# EAGLE schematic Debug (EAGLE 5.09)
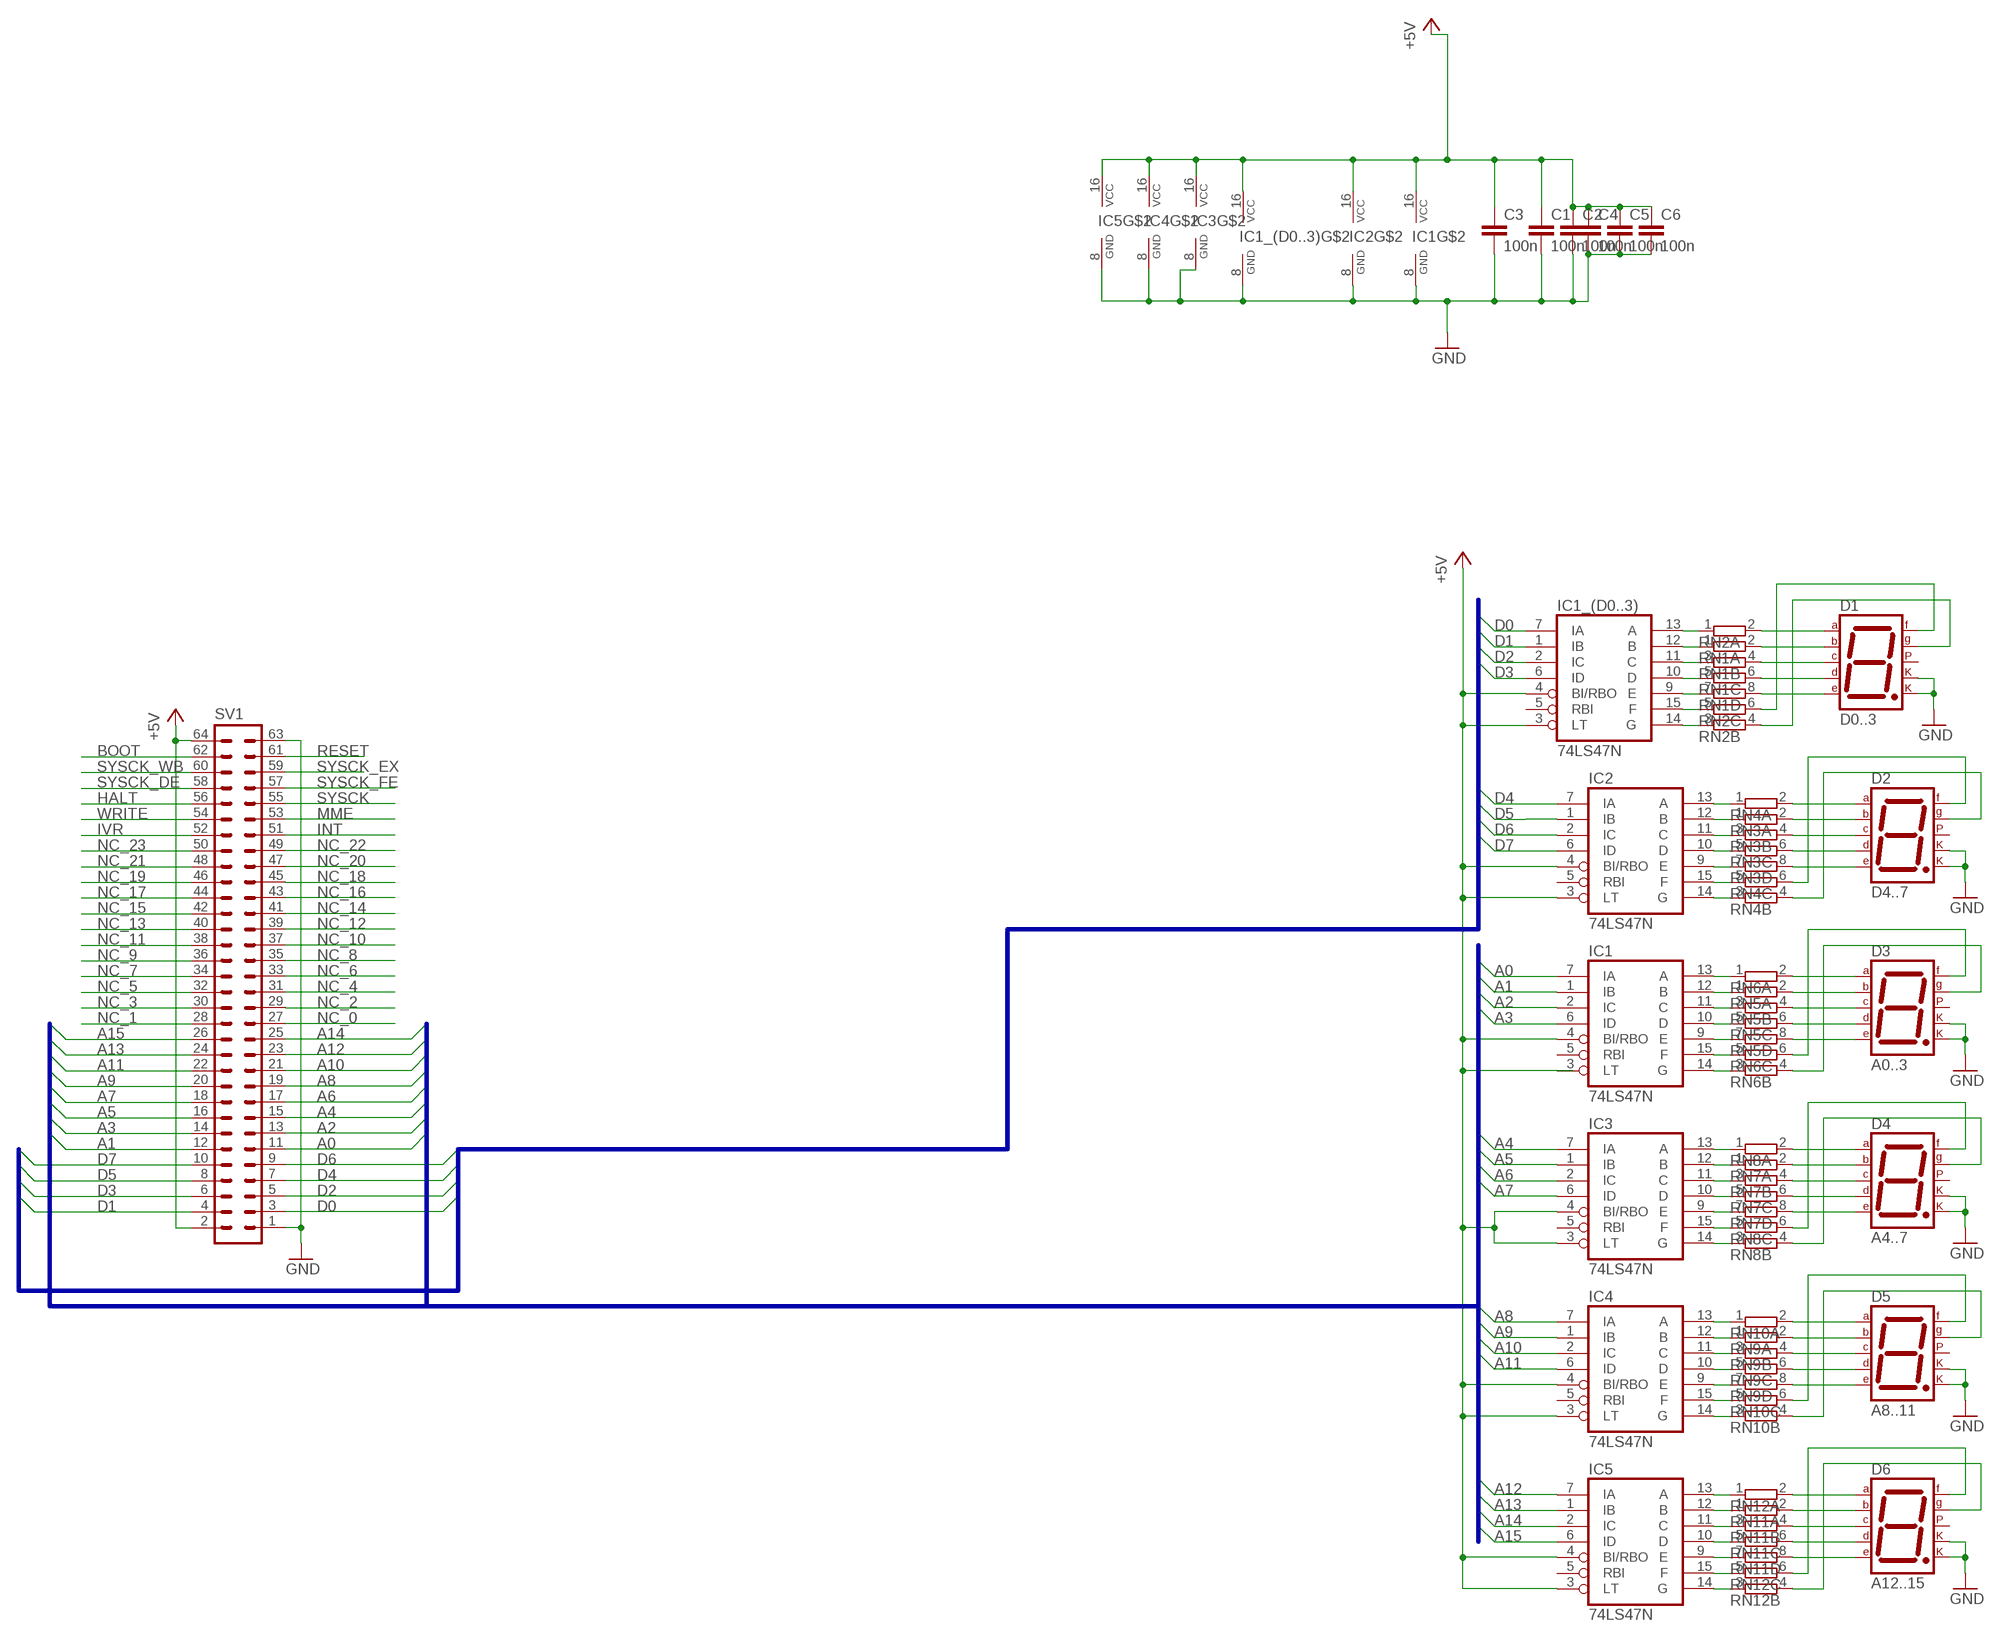
[diagram p0: schematic, sheet 1]

## Parts
C1  100n  C-EU025-024X044  [C025-024X044]
C2  100n  C-EU025-024X044  [C025-024X044]
C3  100n  C-EU025-024X044  [C025-024X044]
C4  100n  C-EU025-024X044  [C025-024X044]
C5  100n  C-EU025-024X044  [C025-024X044]
C6  100n  C-EU025-024X044  [C025-024X044]
D1  D0..3  7SEG-CK  [7SEG-13]
D2  D4..7  7SEG-CK  [7SEG-13]
D3  A0..3  7SEG-CK  [7SEG-13]
D4  A4..7  7SEG-CK  [7SEG-13]
D5  A8..11  7SEG-CK  [7SEG-13]
D6  A12..15  7SEG-CK  [7SEG-13]
IC1  74LS47N  [DIL16]
IC1_(D0..3)  74LS47N  [DIL16]
IC2  74LS47N  [DIL16]
IC3  74LS47N  [DIL16]
IC4  74LS47N  [DIL16]
IC5  74LS47N  [DIL16]
RN1  E4R  [SIL8]
RN2  E4R  [SIL8]
RN3  E4R  [SIL8]
RN4  E4R  [SIL8]
RN5  E4R  [SIL8]
RN6  E4R  [SIL8]
RN7  E4R  [SIL8]
RN8  E4R  [SIL8]
RN9  E4R  [SIL8]
RN10  E4R  [SIL8]
RN11  E4R  [SIL8]
RN12  E4R  [SIL8]
SV1  ML64L  [ML64L]

## Nets
+5V: C1.1 C2.1 C3.1 C4.1 C5.1 C6.1 IC1.4(BI/RBO) IC1.16(VCC) IC1_(D0..3).3(LT) IC1_(D0..3).4(BI/RBO) IC1_(D0..3).16(VCC) IC2.3(LT) IC2.4(BI/RBO) IC2.16(VCC) IC3.3(LT) IC3.4(BI/RBO) IC3.16(VCC) IC4.3(LT) IC4.4(BI/RBO) IC4.16(VCC) IC5.3(LT) IC5.4(BI/RBO) IC5.16(VCC) SV1.2 SV1.64
A0: IC1.7(IA) SV1.11
A1: IC1.1(IB) SV1.12
A2: IC1.2(IC) SV1.13
A3: IC1.6(ID) SV1.14
A4: IC3.7(IA) SV1.15
A5: IC3.1(IB) SV1.16
A6: IC3.2(IC) SV1.17
A7: IC3.6(ID) SV1.18
A8: IC4.7(IA) SV1.19
A9: IC4.1(IB) SV1.20
A10: IC4.2(IC) SV1.21
A11: IC4.6(ID) SV1.22
A12: IC5.7(IA) SV1.23
A13: IC5.1(IB) SV1.24
A14: IC5.2(IC) SV1.25
A15: IC5.6(ID) SV1.26
BOOT: SV1.62
D0: IC1_(D0..3).7(IA) SV1.3
D1: IC1_(D0..3).1(IB) SV1.4
D2: IC1_(D0..3).2(IC) SV1.5
D3: IC1_(D0..3).6(ID) SV1.6
D4: IC2.7(IA) SV1.7
D5: IC2.1(IB) SV1.8
D6: IC2.2(IC) SV1.9
D7: IC2.6(ID) SV1.10
GND: C1.2 C2.2 C3.2 C4.2 C5.2 C6.2 D1.3(CK1) D1.8(CK2) D2.3(CK1) D2.8(CK2) D3.3(CK1) D3.8(CK2) D4.3(CK1) D4.8(CK2) D5.3(CK1) D5.8(CK2) D6.3(CK1) D6.8(CK2) IC1.8(GND) IC1_(D0..3).8(GND) IC2.8(GND) IC3.8(GND) IC4.8(GND) IC5.8(GND) SV1.1 SV1.63
HALT: SV1.56
INT: SV1.51
IVR: SV1.52
MME: SV1.53
N$1: IC1_(D0..3).13(A) RN2.1
N$2: IC1_(D0..3).12(B) RN1.1
N$3: IC1_(D0..3).11(C) RN1.3
N$4: IC1_(D0..3).10(D) RN1.5
N$5: IC1_(D0..3).9(E) RN1.7
N$6: IC1_(D0..3).15(F) RN2.5
N$7: IC1_(D0..3).14(G) RN2.3
N$8: D1.7(A) RN2.2
N$9: D1.6(B) RN1.2
N$10: D1.4(C) RN1.4
N$11: D1.2(D) RN1.6
N$12: D1.1(E) RN1.8
N$13: D1.9(F) RN2.6
N$14: D1.10(G) RN2.4
N$15: IC2.13(A) RN4.1
N$16: IC2.12(B) RN3.1
N$17: IC2.11(C) RN3.3
N$18: IC2.10(D) RN3.5
N$19: IC2.9(E) RN3.7
N$20: IC2.15(F) RN4.5
N$21: IC2.14(G) RN4.3
N$22: D2.7(A) RN4.2
N$23: D2.6(B) RN3.2
N$24: D2.4(C) RN3.4
N$25: D2.2(D) RN3.6
N$26: D2.1(E) RN3.8
N$27: D2.9(F) RN4.6
N$28: D2.10(G) RN4.4
N$29: IC1.13(A) RN6.1
N$30: IC1.12(B) RN5.1
N$31: IC1.11(C) RN5.3
N$32: IC1.10(D) RN5.5
N$33: IC1.9(E) RN5.7
N$34: IC1.15(F) RN6.5
N$35: IC1.14(G) RN6.3
N$36: D3.7(A) RN6.2
N$37: D3.6(B) RN5.2
N$38: D3.4(C) RN5.4
N$39: D3.2(D) RN5.6
N$40: D3.1(E) RN5.8
N$41: D3.9(F) RN6.6
N$42: D3.10(G) RN6.4
N$43: IC3.13(A) RN8.1
N$44: IC3.12(B) RN7.1
N$45: IC3.11(C) RN7.3
N$46: IC3.10(D) RN7.5
N$47: IC3.9(E) RN7.7
N$48: IC3.15(F) RN8.5
N$49: IC3.14(G) RN8.3
N$50: D4.7(A) RN8.2
N$51: D4.6(B) RN7.2
N$52: D4.4(C) RN7.4
N$53: D4.2(D) RN7.6
N$54: D4.1(E) RN7.8
N$55: D4.9(F) RN8.6
N$56: D4.10(G) RN8.4
N$57: IC4.13(A) RN10.1
N$58: IC4.12(B) RN9.1
N$59: IC4.11(C) RN9.3
N$60: IC4.10(D) RN9.5
N$61: IC4.9(E) RN9.7
N$62: IC4.15(F) RN10.5
N$63: IC4.14(G) RN10.3
N$64: D5.7(A) RN10.2
N$65: D5.6(B) RN9.2
N$66: D5.4(C) RN9.4
N$67: D5.2(D) RN9.6
N$68: D5.1(E) RN9.8
N$69: D5.9(F) RN10.6
N$70: D5.10(G) RN10.4
N$71: IC5.13(A) RN12.1
N$72: IC5.12(B) RN11.1
N$73: IC5.11(C) RN11.3
N$74: IC5.10(D) RN11.5
N$75: IC5.9(E) RN11.7
N$76: IC5.15(F) RN12.5
N$77: IC5.14(G) RN12.3
N$78: D6.7(A) RN12.2
N$79: D6.6(B) RN11.2
N$80: D6.4(C) RN11.4
N$81: D6.2(D) RN11.6
N$82: D6.1(E) RN11.8
N$83: D6.9(F) RN12.6
N$84: D6.10(G) RN12.4
NC_0: SV1.27
NC_1: SV1.28
NC_2: SV1.29
NC_3: SV1.30
NC_4: SV1.31
NC_5: SV1.32
NC_6: SV1.33
NC_7: SV1.34
NC_8: SV1.35
NC_9: SV1.36
NC_10: SV1.37
NC_11: SV1.38
NC_12: SV1.39
NC_13: SV1.40
NC_14: SV1.41
NC_15: SV1.42
NC_16: SV1.43
NC_17: SV1.44
NC_18: SV1.45
NC_19: SV1.46
NC_20: SV1.47
NC_21: SV1.48
NC_22: SV1.49
NC_23: SV1.50
RESET: SV1.61
SYSCK: SV1.55
SYSCK_DE: SV1.58
SYSCK_EX: SV1.59
SYSCK_FE: SV1.57
SYSCK_WB: SV1.60
WRITE: SV1.54
Unconnected: D1.5(DP) D2.5(DP) D3.5(DP) D4.5(DP) D5.5(DP) D6.5(DP) IC1.3(LT) IC1.5(RBI) IC1_(D0..3).5(RBI) IC2.5(RBI) IC3.5(RBI) IC4.5(RBI) IC5.5(RBI) RN2.7 RN2.8 RN4.7 RN4.8 RN6.7 RN6.8 RN8.7 RN8.8 RN10.7 RN10.8 RN12.7 RN12.8

## Buses
D[0..7]
A[0..15]

## Library data of the parts
C1-C6 = rcl:C-EU: CAPACITOR, European symbol
D1-D6 = special:7SEG-CK: 7-segment DISPLAY single cathode, 13 mm
IC1 IC1_(D0..3) IC2-IC5 = 74xx-eu:74*47: BCD to seven segment DECODER/DRIVER Source: http://www.ee.washington.edu/stores/DataSheets/74ls/74ls47.pdf
RN1-RN12 = resistor-sil:E4R: SIL RESISTOR
SV1 = con-ml:ML64L: HARTING

## Net classes
0 Signal: width 0.305 mm, drill 0.508 mm, clearance 0.203 mm
1 LoVolt42: width 0.61 mm, drill 0.508 mm, clearance 0.813 mm to class 0, clearance 0.305 mm
2 MedVolt100: width 0.61 mm, drill 0.508 mm, clearance 1.626 mm to class 0, clearance 1.626 mm to class 1, clearance 0.813 mm
3 LineVolt350: width 0.813 mm, drill 0.508 mm, clearance 12.7 mm to class 0, clearance 12.7 mm to class 1, clearance 12.7 mm to class 2, clearance 2.54 mm